# EAGLE schematic resistors (EAGLE 9.3.1)
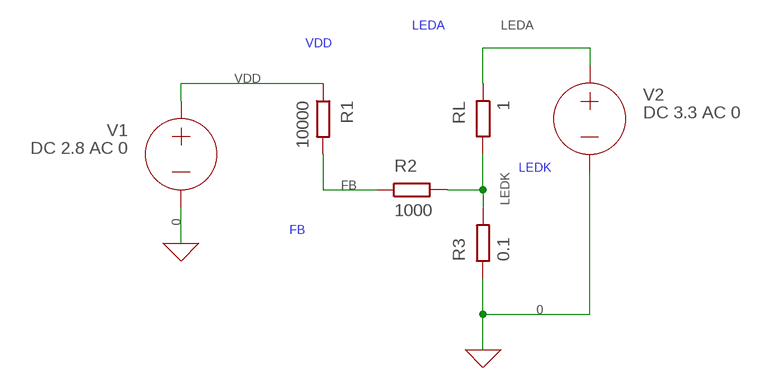
[diagram p0: schematic, sheet 1]

## Parts
R1  10000  R  (no package)
R2  1000  R  (no package)
R3  0.1  R  (no package)
RL  1  R  (no package)
V1  DC 2.8 AC 0  VOLTAGE  (no package)
V2  DC 3.3 AC 0  VOLTAGE  (no package)

## Nets
0: R3.1 V1.- V2.- ; supply symbol labelled GND
FB: R1.2 R2.1
LEDA: RL.1 V2.+
LEDK: R2.2 R3.2 RL.2
VDD: R1.1 V1.+

## Library data of the parts
R1-R3 RL = ngspice-simulation:R: RESISTOR
V1 V2 = ngspice-simulation:VOLTAGE: Independent Voltage Source, either DC, AC, PULSE, SINE, PWL, EXP, or SFFM; VALUE: 0V